# Altium project SMPS_ProjectCAS.PrjPcb
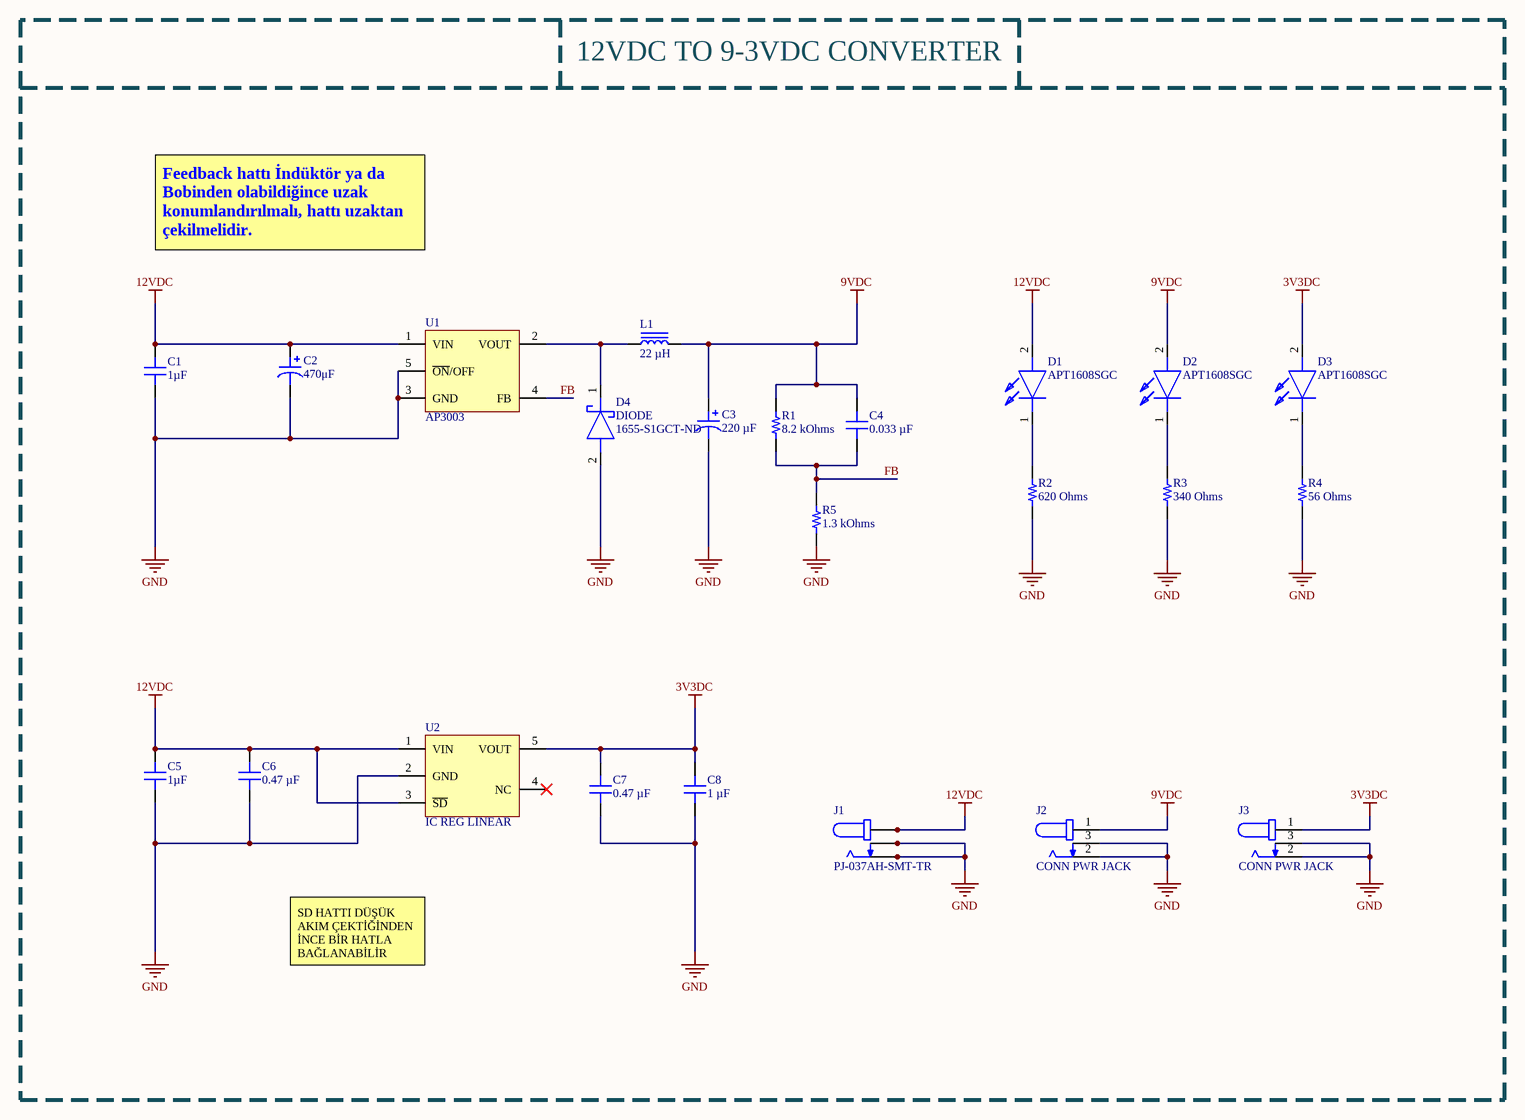
[diagram p0: CAS_SMPS_Sheet.SchDoc]
1 sheet, 23 parts. Net scope: global (net labels, ports and power ports of the same name join across sheets).
Board file: CAS_SMPS_PCB.PcbDoc

## Sheet CAS_SMPS_Sheet.SchDoc
size A3; SheetNumber: 1; SheetTotal: 1

### Parts
C1  1µF  [CAP 0603_1608]
C2  470μF  [CAP ALSMD 8.3MM H10.5MM]
C3  220 µF  [CAP ALSMD 8.3MM H10.5MM]
C4  0.033 µF  [CAP 0603_1608]
C5  1µF  [CAP 0603_1608]
C6  0.47 µF  [CAP 0603_1608]
C7  0.47 µF  [CAP 0603_1608]
C8  1 µF  [CAP 0603_1608]
D1  APT1608SGC  [LED]
D2  APT1608SGC  [LED]
D3  APT1608SGC  [LED]
D4  DIODE  Supplier Part Number 1: 1655-S1GCT-ND  [DIODE2]
J1  PJ-037AH-SMT-TR  [JACK1]
J2  CONN PWR JACK  [JACK2]
J3  CONN PWR JACK  [JACK2]
L1  22 µH  [BOURNS SRR1280]
R1  8.2 kOhms  [RES 0603_1608]
R2  620 Ohms  [RES 0603_1608]
R3  340 Ohms  [RES 0603_1608]
R4  56 Ohms  [RES 0603_1608]
R5  1.3 kOhms  [RES 0603_1608]
U1  AP3003  [TO-263-5]
U2  IC REG LINEAR  [SOT-23-5]

### Blocks framed on the sheet
12VDC TO 9-3VDC CONVERTER: C1-C8 D1-D4 J1-J3 L1 R1-R5 U1 U2

### Nets
3V3DC: C7.2 C8.2 D3.2(A) J3.1 U2.5(VOUT)
9VDC: C3.1 C4.1 D2.2(A) J2.1 L1.2 R1.2
12VDC: C1.2 C2.1 C5.2 C6.2 D1.2(A) J1.1A J1.1B U1.1(VIN) U2.1(VIN) U2.3(~{SD})
GND: C1.1 C2.2 C3.2 C5.1 C6.1 C7.1 C8.1 D4.2(A) J1.2A J1.2B J1.3A J1.3B J2.2 J2.3 J3.2 J3.3 R2.1 R3.1 R4.1 R5.2 U1.3(GND) U1.5(~{ON}/OFF) U2.2(GND)
FB: C4.2 R1.1 R5.1 U1.4(FB)
NetD1_1: D1.1(K) R2.2
NetD2_1: D2.1(K) R3.2
NetD3_1: D3.1(K) R4.2
NetD4_1: D4.1(K) L1.1 U1.2(VOUT)

Not connected (* = marked no-connect by the designer): U2 4(NC)*

### Notes on the sheet
- Feedback hattı İndüktör ya da Bobinden olabildiğince uzak konumlandırılmalı, hattı uzaktan çekilmelidir.
- SD HATTI DÜŞÜK AKIM ÇEKTİĞİNDEN İNCE BİR HATLA BAĞLANABİLİR
- Engineer
- Company Name
- Sheet Number
- Project Name =>
- Date

### Library data of the parts
C1 C5 = 06033D105MAT2A: CAP CER 1UF 25V X5R 0603; Part Number: 06033D105MAT2A; Value: 1µF
C2 = 25TPV470M8X10.5: CAP ALUM 470UF 20% 25V SMD; Part Number: 25TPV470M8X10.5
C3 = 25TXV220M8X10.5: CAP ALUM 220UF 20% 25V SMD; manufacturer: Rubycon; ESR (Equivalent Series Resistance): 300mOhm; Lifetime @ Temp.: 2000 Hrs @ 125°C; Polarization: Polar; Ripple Current @ High Frequency: 220 mA @ 100 kHz; Ripple Current @ Low Frequency: 132 mA @ 120 Hz; Surface Mount Land Size: 0.327" L x 0.327" W (8.30mm x 8.30mm); Part Number: 25TXV220M8X10.5; Applications: Automotive; Capacitance: 220 µF; componentlink1description: Datasheet; componentlink1url: http://www.rubycon.co.jp/en/catalog/e_pdfs/aluminum/e_txv.pdf; componentlink2description: DigiKey Link; componentlink2url: https://www.digikey.com/en/products/detail/rubycon/25TXV220M8X10-5/3568741; Device Package: Radial, Can - SMD; Height - Seated (Max): 0.413" (10.50mm); lastupdated: 17.05.2023 20:53:00; Lifecycle Status: Active; Minimum Order: 1; Mounting Type: Surface Mount; Operating Temperature: -40°C ~ 125°C; Package / Case: Radial, Can - SMD; packaging: TapeAndReel; partid: 7686; Part Status: Active; price: 0.20; Ratings: AEC-Q200; series: TXV; Size / Dimension: 0.315" Dia (8.00mm); Supplier 1: DigiKey; Supplier Part Number 1: 1189-2122-1-ND; Tolerance: ±20%; value: 220 µF; Voltage - Rated: 25 V
C4 = C0603C333J4REC7411: CAP CER 0603 33NF 16V X7R 5%; Part Number: C0603C333J4REC7411; Value: 0.033 µF
C6 C7 = CC0603KRX5R8BB474: CAP CER 0.47UF 25V X5R 0603; Part Number: CC0603KRX5R8BB474; Value: 0.47 µF
C8 = C0603C105K4RACAUTO: CAP CER 1UF 16V X7R 0603; Part Number: C0603C105K4RACAUTO; Value: 1 µF
D1-D3 = APT1608SGC: LED GREEN CLEAR 0603 SMD; Manufacturer: Kingbright; Forward Voltage: 2.2V; Viewing Angle: 120°; Forward Current: 20mA; Luminous Intensity: 15mcd; Lens Style: Clear,Flat; Dominant Wavelength: 568nm; Number of LEDs: 1; Supplier 1: Digi-Key; Manufacturer Part Number: APT1608SGC; RoHS: Yes; Category: LEDs; Stock 1: 173873; Pricing 1: 1=0,3, 10=0,235, 100=0,1054, 500=0,09518, 1000=0,07818 (USD); Mount: Surface Mount; Case/Package: 0603; Number of Pins: 2; Color: Green; Case Code (Metric): 1608; Case Code (Imperial): 0603; Lens Color: Clear; Min Operating Temperature: -40°C; Max Operating Temperature: 85°C; Package Quantity: 2000; Illumination Color: Green; Packaging: Tape and Reel; Test Current: 20mA; Wavelength: 568nm; Series: APT; Length: 1.6mm; Width: 0.8mm; Height: 0.75mm; Lead Free: Lead Free; RoHS Compliant: Yes; ComponentLink1URL: https://datasheet.ciiva.com/12400/apt1608sgc-32861-12400932.pdf?src-supplier=Mouser; ComponentLink1Description: https://datasheet.ciiva.com/12400/apt1608sgc-32861-12400932.pdf?src-supplier=Mouser; ComponentLink2URL: https://datasheet.ciiva.com/2113/apt1608sgc-2113808.pdf?src-supplier=Digi-Key; ComponentLink2Description: https://datasheet.ciiva.com/2113/apt1608sgc-2113808.pdf?src-supplier=Digi-Key; ComponentLink3URL: https://datasheet.ciiva.com/14603/70062839-14603927.pdf?src-supplier=Allied+Electronics; ComponentLink3Description: https://datasheet.ciiva.com/14603/70062839-14603927.pdf?src-supplier=Allied+Electronics; Supplier Part Number 1: 754-1121-1-ND
D4 = DIODE: Manufacturer: Sangdest Microelectronics; Manufacturer Part Number: S1G; Supplier 1: Digi-Key; RoHS: No; Stock 1: 552177; Pricing 1: 1=0,13, 10=0,12, 100=0,0655, 500=0,04034, 1000=0,0275, 2000=0,02338 (USD)
J1 = PJ-037AH-SMT-TR: 2.0 x 6.3 mm, 5.0 A, Horizontal, Surface Mount (SMT), Dc Power Jack Connector; Manufacturer: CUI; Number of Conductors: 2; Gender: Male; Shielding: Unshielded; Current Rating: 5A; Voltage Rating: 24V; Insulation Resistance: 100MR; Supplier 1: Digi-Key; Manufacturer Part Number: PJ-037AH-SMT-TR; RoHS: Yes; Category: Uncategorized; Stock 1: 44; Pricing 1: 1=1,500000, 10=1,304000, 25=1,248800, 50=1,221000 (USD); Mount: Surface Mount,Through Hole; Case/Package: SMD/SMT; Color: Black; Contact Material: Copper; Contact Plating: Nickel; Housing Color: Black; Housing Material: Thermoplastic; Min Operating Temperature: -25°C; Max Operating Temperature: 85°C; Orientation: Horizontal; Termination: Solder; Connector Type: Jack; Package Quantity: 200; Contact Gender: Male; Packaging: Tape and Reel; Flammability Rating: UL94 V-0; ComponentLink1URL: http://www.mouser.com/ds/2/670/pj-037ah-smt-516065.pdf?src-supplier=Mouser; ComponentLink1Description: http://www.mouser.com/ds/2/670/pj-037ah-smt-516065.pdf?src-supplier=Mouser; ComponentLink2URL: https://www.cui.com/product/resource/digikeypdf/pj-037ah-smt-tr.pdf?src-supplier=Digi-Key; ComponentLink2Description: https://www.cui.com/product/resource/digikeypdf/pj-037ah-smt-tr.pdf?src-supplier=Digi-Key; ComponentLink3URL: http://www.cui.com/product/resource/digikeypdf/pj-037ah-smt.pdf?src-supplier=Digi-Key; ComponentLink3Description: http://www.cui.com/product/resource/digikeypdf/pj-037ah-smt.pdf?src-supplier=Digi-Key; Supplier Part Number 1: CP-037AHPJCT-ND
J2 J3 = PJ-006A-SMT-TR: Power Barrel Connector Jack 2.00mm ID (0.079; Manufacturer: CUI; Gender: Male; Shielding: Unshielded; Current Rating: 4A; Connector Type: Jack,Power; Voltage Rating: 18V; Insulation Resistance: 100MR; Supplier 1: Arrow Electronics; Manufacturer Part Number: PJ-006A-SMT-TR; RoHS: Yes; Category: Uncategorized; Mount: Surface Mount; Case/Package: SMD/SMT; Color: Black; Contact Material: Copper; Contact Plating: Nickel; Housing Color: Black; Housing Material: Thermoplastic; Min Operating Temperature: -20°C; Max Operating Temperature: 85°C; Package Quantity: 250; Termination: Solder; Contact Gender: Male; Series: -; Lead Free: Lead Free; Flammability Rating: UL94 V-0; RoHS Compliant: Yes; ComponentLink1URL: https://datasheet.ciiva.com/16478/pj-006a-smt-16478075.pdf?src-supplier=Future+Electronics; ComponentLink1Description: https://datasheet.ciiva.com/16478/pj-006a-smt-16478075.pdf?src-supplier=Future+Electronics; Supplier Part Number 1: PJ-006A-SMT-TR
L1 = SRR1280-220M: FIXED IND 22UH 4.3A 38.6MOHM SMD; Manufacturer: Bourns Inc.; Current - Saturation: 4.1A; DC Resistance (DCR): 38.6mOhm Max; Frequency - Self Resonant: 11MHz; Inductance Frequency - Test: 100 kHz; Material - Core: Ferrite; Q @ Freq: 20 @ 2.52MHz; Shielding: Shielded; Tolerance: ±20%; Type: Drum Core, Wirewound; Part Number: SRR1280-220M; ComponentLink1Description: Datasheet; ComponentLink1URL: https://www.bourns.com/docs/Product-Datasheets/SRR1280.pdf; ComponentLink2Description: DigiKey Link; ComponentLink2URL: https://www.digikey.com/en/products/detail/bourns-inc/SRR1280-220M/1969996; Current Rating (Amps): 4.3 A; Device Package: Nonstandard; Height - Seated (Max): 0.315" (8.00mm); Inductance: 22 µH; LastUpdated: 17.05.2023 20:36:29; Lifecycle Status: Active; Minimum Order: 1; Mounting Type: Surface Mount; Operating Temperature: -40°C ~ 125°C; Package / Case: Nonstandard; Packaging: TapeAndReel; PartId: 18; Part Status: Active; Price: 0.53; Series: SRR1280; Size / Dimension: 0.492" L x 0.492" W (12.50mm x 12.50mm); Supplier 1: DigiKey; Supplier Part Number 1: SRR1280-220MCT-ND; Value: 22 µH
R1 = RT0603BRB078K2L: RES SMD 8.2K OHM 0.1% 1/10W 0603; Part Number: RT0603BRB078K2L; Value: 8.2 kOhms
R2 = ERA-3AED621V: RES SMD 620 OHM 0.5% 1/10W 0603; Part Number: ERA-3AED621V; Value: 620 Ohms
R3 = RC0603FR-07340RL: RES 340 OHM 1% 1/10W 0603; Part Number: RC0603FR-07340RL; Value: 340 Ohms
R4 = CRGP0603F56R: RES 56 OHM 1% 1/4W 0603; Part Number: CRGP0603F56R; Value: 56 Ohms
R5 = RQ73C1J1K3BTDF: RQ 0603 1K3 0.1% 10PPM 1K RL; Part Number: RQ73C1J1K3BTDF; Value: 1.3 kOhms
U1 = AP3003: IC REG BUCK ADJ 3A TO263-5
U2 = ADP3309ARTZ-3.3-R7: LDO Regulator Pos 3.3V 0.1A 5-Pin SOT-23 T/R / IC REG LDO 3.3V 0.1A SOT23-5; Manufacturer: Analog Devices; Number of Outputs: 1; Max Input Voltage: 12V; Min Input Voltage: 2.8V; Polarity: Positive; Accuracy: 1.2%; Output Type: Fixed; Output Current: 100mA; Dropout Voltage: 120mV; Min Output Voltage: 2.5V; Quiescent Current: 1uA; Nominal Supply Current: 2mA; Power Supply Rejection Ratio (PSRR): 60dB; Max Output Voltage: 3.6V; Supplier 1: Digi-Key; Manufacturer Part Number: ADP3309ARTZ-3.3-R7; RoHS: Yes; Category: Voltage Regulators - Linear; Stock 1: 2658; Pricing 1: 1=2,92, 10=2,624, 25=2,4804, 100=2,1497, 250=2,03944, 500=1,82998, 1000=1,56 (USD); Case/Package: SOT-23-5; Number of Pins: 5; Min Operating Temperature: -20°C; Max Operating Temperature: 85°C; Output Voltage: 3.3V; Nominal Output Voltage: 3.3V; Package Quantity: 3000; Max Output Current: 100mA; Packaging: Tape and Reel; Number of Regulators: 1; Output Voltage Accuracy: 1.2%; Operating Supply Current: 2mA; Max Supply Current: 2mA; Series: anyCAP®; Length: 2.9mm; Width: 1.6mm; Height: 1.3mm; Radiation Hardening: No; Reach SVHC Compliant: No; Lead Free: Contains Lead; RoHS Compliant: Yes; ComponentLink1URL: https://datasheet.ciiva.com/2041/adp3309-2041025.pdf?src-supplier=Digi-Key; ComponentLink1Description: https://datasheet.ciiva.com/2041/adp3309-2041025.pdf?src-supplier=Digi-Key; ComponentLink2URL: https://datasheet.ciiva.com/28435/1694316-28435698.pdf?src-supplier=Element14; ComponentLink2Description: https://datasheet.ciiva.com/28435/1694316-28435698.pdf?src-supplier=Element14; ComponentLink3URL: https://datasheet.ciiva.com/2041/adp3309-2041026.pdf?src-supplier=Digi-Key; ComponentLink3Description: https://datasheet.ciiva.com/2041/adp3309-2041026.pdf?src-supplier=Digi-Key; ComponentLink4URL: https://datasheet.ciiva.com/2041/adp3309-2041027.pdf?src-supplier=Digi-Key; ComponentLink4Description: https://datasheet.ciiva.com/2041/adp3309-2041027.pdf?src-supplier=Digi-Key; ComponentLink5URL: https://datasheet.ciiva.com/8241/adp3309-8241749.pdf?src-supplier=Avnet; ComponentLink5Description: https://datasheet.ciiva.com/8241/adp3309-8241749.pdf?src-supplier=Avnet; ComponentLink6URL: https://datasheet.ciiva.com/3224/adp3309-3224702.pdf?src-supplier=Avnet; ComponentLink6Description: https://datasheet.ciiva.com/3224/adp3309-3224702.pdf?src-supplier=Avnet; Supplier Part Number 1: ADP3309ARTZ-3.3-R7CT-ND